# Altium schematic sheet USB2Serial.SchDoc
size A3; SheetTitle: USB2Serial; SheetNumber: 2
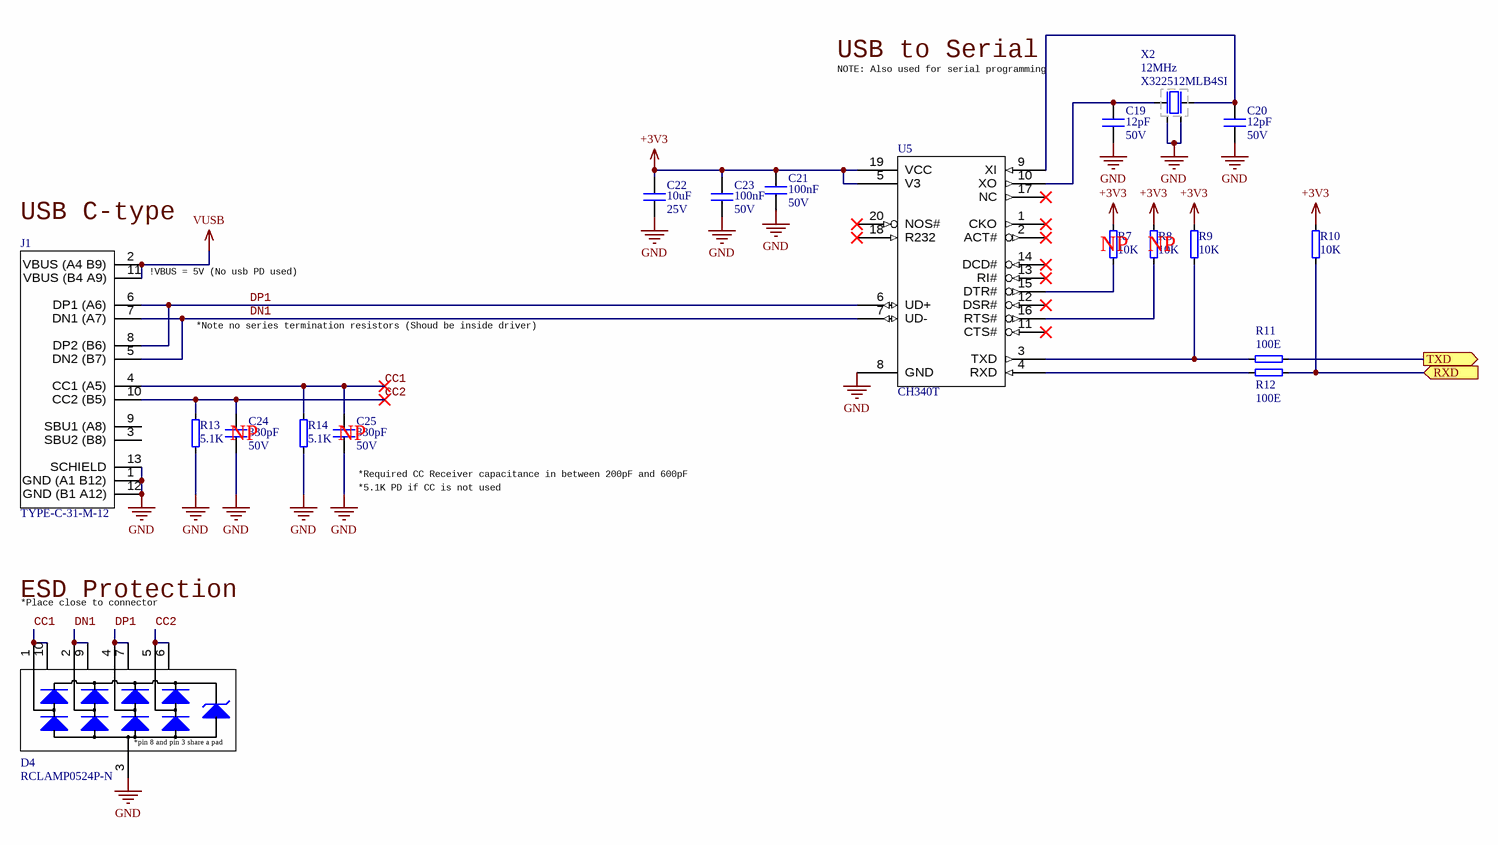
[diagram p0: USB2Serial.SchDoc]

## Parts
C19  12pF  Voltage: 50V  [CAP 0603 1608 IPC MEDIUM]
C20  12pF  Voltage: 50V  [CAP 0603 1608 IPC MEDIUM]
C21  100nF  Voltage: 50V  [CAP 0603 1608 IPC MEDIUM]
C22  10uF  Voltage: 25V  [CAP 1206 3216 IPC MEDIUM]
C23  100nF  Voltage: 50V  [CAP 0603 1608 IPC MEDIUM]
C24  330pF  Voltage: 50V  [CAP 0603 1608 IPC MEDIUM]
C25  330pF  Voltage: 50V  [CAP 0603 1608 IPC MEDIUM]
D4  RCLAMP0524P-N  [RCLAMP0524P-N - BORN]
J1  TYPE-C-31-M-12  [TYPE-C-31-M-12 - KOREAN HROPARTS ELEC]
R7  10K  [RES 0603 1608 IPC MEDIUM]
R8  10K  [RES 0603 1608 IPC MEDIUM]
R9  10K  [RES 0603 1608 IPC MEDIUM]
R10  10K  [RES 0603 1608 IPC MEDIUM]
R11  100E  [RES 0603 1608 IPC MEDIUM]
R12  100E  [RES 0603 1608 IPC MEDIUM]
R13  5.1K  [RES 0603 1608 IPC MEDIUM]
R14  5.1K  [RES 0603 1608 IPC MEDIUM]
U5  CH340T  [CH340T - WCH]
X2  X322512MLB4SI  Frequency: 12MHz  [X322512MLB4SI - YXC]

## Ports
RXD (in), TXD (out)

## Nets
+3V3: C21.1 C22.1 C23.1 R7.1 R8.1 R9.1 R10.1 U5.5(V3) U5.19(VCC)
GND: C19.2 C20.2 C21.2 C22.2 C23.2 C24.2 C25.2 D4.3(3_8) J1.1(GND_(A1_B12)) J1.12(GND_(B1_A12)) J1.13(SCHIELD) R13.2 R14.2 U5.8(GND) X2.2(GND) X2.4(GND)
VUSB: J1.2(VBUS_(A4_B9)) J1.11(VBUS_(B4_A9))
CC1: C25.1 D4.1 D4.10(NC) J1.4(CC1_(A5)) R14.1
CC2: C24.1 D4.5 D4.6(NC) J1.10(CC2_(B5)) R13.1
DN1: D4.2 D4.9(NC) J1.5(DN2_(B7)) J1.7(DN1_(A7)) U5.7(UD-)
DP1: D4.4 D4.7(NC) J1.6(DP1_(A6)) J1.8(DP2_(B6)) U5.6(UD+)
RXD: R10.2 R12.2 ; port RXD
TXD: R11.2 ; port TXD
NetC19_1: C19.1 U5.10(XO) X2.3(out)
NetC20_1: C20.1 U5.9(XI) X2.1(in)
NetR7_2: R7.2 U5.15(DTR#)
NetR8_2: R8.2 U5.16(RTS#)
NetR9_2: R9.2 R11.1 U5.3(TXD)
NetR12_1: R12.1 U5.4(RXD)

Not connected (* = marked no-connect by the designer): J1 3(SBU2_(B8)) 9(SBU1_(A8)); U5 1(CKO)* 2(ACT#)* 11(CTS#)* 12(DSR#)* 13(RI#)* 14(DCD#)* 17(NC)* 18(R232)* 20(NOS#)*

## Notes on the sheet
- USB to Serial
- NOTE: Also used for serial programming
- (near J1) USB C-type
- (near J1) !VBUS = 5V (No usb PD used)
- (near R7) NP
- (near R8) NP
- *Note no series termination resistors (Shoud be inside driver)
- (near C24) NP
- (near C25) NP
- (near C25) *5.1K PD if CC is not used
- (near C25) *Required CC Receiver capacitance in between 200pF and 600pF
- ESD Protection
- *Place close to connector
- Date:
- Client:
- Project:
- Sheet:
- Number:
- Title:
- of
- Size:
- Revision:
- A3
- File:
- Author:
- (in symbol 5) *pin 8 and pin 3 share a pad

## Library data of the parts
C19 C20 = 15: 12pF ±5% 50V NP0 0603 Multilayer Ceramic Capacitors MLCC - SMD/SMT RoHS; Part Number: CC0603JRNPO9BN120; Manufacturer: YAGEO; DB_ID: 15; Dielectric: C0G/NP0; Max Temperature: 125°C; Case Technology: SMT; Capacitance: 12pF; Tolerance: 5%; Supplier 1: LCSC; Supplier 2: Farnell; ComponentLink1Description: Octopart Search; ComponentLink1URL: https://octopart.com/cc0603jrnpo9bn120-yageo-9289271?r=sp; Supplier 3: Mouser; Supplier Part Number 1: C107034; Supplier Part Number 2: 721979; Supplier Part Number 3: 603-CC603JRNPO9BN120
C21 C23 = 62: 100nF ±10% 50V X7R 0603 Multilayer Ceramic Capacitors MLCC - SMD/SMT RoHS; Part Number: C0603B104K500NT; Manufacturer: TORCH; DB_ID: 62; Tolerance: 20%; Max Temperature: 125°C; Case Technology: SMT; Capacitance: 100nF; Dielectric: X7R; Supplier 1: LCSC; Supplier Part Number 1: C478888; ComponentLink1Description: Octopart Search; ComponentLink1URL: http://octopart.com/search?q=C0603C104M4RACTU%20KEMET
C22 = 86: 10uF ±10% 25V X5R 1206 Multilayer Ceramic Capacitors MLCC - SMD/SMT RoHS; Part Number: CL31A106KAHNNNE; Manufacturer: SAMSUNG; DB_ID: 86; Max Temperature: 85°C; Case Technology: SMT; Capacitance: 10uF; Dielectric: X5R; Tolerance: 10%; Supplier 1: LCSC; Supplier 2: Farnell; Supplier Part Number 1: C9807; ComponentLink1Description: Octopart Search; ComponentLink1URL: https://octopart.com/search?q=CL31A106KAHNNNE&currency=USD&specs=0; Supplier 3: Mouser; Supplier Part Number 2: 3013511; Supplier Part Number 3: 187-CL31A106KAHNNNE
C24 C25 = 32: Generic 0603 1608 Capacitor; Part Number: CL10C331JB8NNNC; Manufacturer: SAMSUNG; DB_ID: 32; Dielectric: C0G/NP0; Tolerance: 5%; Max Temperature: 125°C; Case Technology: SMT; Capacitance: 330pF; Supplier 1: LCSC; Supplier 2: Mouser; ComponentLink1Description: Octopart; ComponentLink1URL: https://octopart.com/cl10c331jb8nnnc-samsung-9287376?r=sp; Supplier 3: Digikey; Supplier Part Number 1: C1664; Supplier Part Number 2: 187-CL10C331JB8NNNC; Supplier Part Number 3: 1276-1073-1-ND
D4 = 5: TVS ARRAY, 40W, 5V, UNIDIRECTIONAL, USB, HDMI; Manufacturer: BORN; DB_ID: 5; Case Technology: SMT; V_BR (Min): 5.5 V; V_BR (max): 7.8 V; Part Number: RCLAMP0524P-N; Polarity: Unidirectional; Working Voltage: 5 V; P_PK: 40 W; Supplier 1: LCSC; Supplier Part Number 1: C316044; ComponentLink1Description: Octopart Search; ComponentLink1URL: https://octopart.com/search?q=RCLAMP0524P-N+BORN&currency=USD&specs=0; ComponentLink2Description: Datasheet; ComponentLink2URL: C:\Users\Admin\stack\Altium\Database_2.0\Datasheets\RCLAMP0524P-N - Datasheet - BORN.pdf; ComponentLink3Description: Product page; ComponentLink3URL: http://www.born-tw.com/
J1 = 54: USB - Type C Female 12-pin; Manufacturer: HRO ELECTRONICS; DB_ID: 54; Row count: 1; Case Technology: SMT; Part Number: TYPE-C-31-M-12; Subcategory: Wire-To-Board; Pin count: 12; Pitch: -; Orientation: Horizontal; Supplier 1: LCSC; Supplier Part Number 1: C165948; ComponentLink1Description: Octopart Search; ComponentLink1URL: https://octopart.com/type-c-31-m-12-hro+electronics-99357592?r=sp; ComponentLink2Description: Datasheet; ComponentLink2URL: C:\Users\Admin\stack\Altium\Database_2.0\Datasheets\TYPE-C-31-M-12 - Drawing - KOREAN HROPARTS ELEC.pdf; ComponentLink3Description: Product page; ComponentLink3URL: http://www.krhro.com/USBjack/20180124/764.html
R7-R10 = 99: 10kΩ ±1% 0.1W ±100ppm/℃ 0603 Chip Resistor - Surface Mount RoHS; Part Number: RC0603FR-0710KL; Manufacturer: YAGEO; DB_ID: 99; Case Technology: SMT; Voltage: 75V; Power: 100mW; Subcategory: Resistor E24 Range; Resistance: 10K; Tolerance: 1%; Supplier 1: LCSC; Supplier Part Number 1: C98220; Supplier 2: Farnell; ComponentLink1Description: Octopart Search; ComponentLink1URL: https://octopart.com/rc0603fr-0710kl-yageo-40025538?r=sp; Supplier 3: Digikey; Supplier Part Number 2: 2421850; Supplier Part Number 3: 311-10.0KHRCT-ND
R11 R12 = 51: 100Ω ±1.0% 1/10W ±100ppm/℃ Thick Film Resistors 75V -55℃~+155℃ 0603 Chip Resistor - Surface Mount RoHS; Part Number: RC0603FR-07100RL; Manufacturer: YAGEO; DB_ID: 51; Case Technology: SMT; Power: 100mW; Tolerance: 1%; Subcategory: Resistor E24 Range; Resistance: 100E; Voltage: 75V; Supplier 1: LCSC; Supplier Part Number 1: C105588; Supplier 2: Farnell; Supplier Part Number 2: 2421848; Supplier 3: Mouser; Supplier Part Number 3: 603-RC0603FR-07100RL; ComponentLink1Description: Octopart Search; ComponentLink1URL: https://octopart.com/rc0603fr-07100rl-yageo-55402879?r=sp#PriceAndStock
R13 R14 = 92: 5.1kΩ ±1% 0.1W 0603 Chip Resistor - Surface Mount RoHS; Part Number: RMC06035.1K1%N; Manufacturer: TYOHM; DB_ID: 92; Case Technology: SMT; Voltage: 50V; Power: 100mW; Subcategory: Resistor E24 Range; Resistance: 5.1K; Tolerance: 1%; Supplier 1: LCSC; Supplier Part Number 1: C269716
U5 = 76: USB to UART Bridge Controller USB 2.0 Full speed 50bps to 2Mbps; Manufacturer: WCH; DB_ID: 76; Case Technology: SMT; Vin min: 3.3 V; Vin max: 5.3 V; Part Number: CH340T; Subcategory: Drivers & Interfaces; Vin typ: -; Supplier 1: LCSC; Supplier Part Number 1: C8689; ComponentLink1Description: Octopart Search; ComponentLink1URL: https://octopart.com/search?q=CH340T&currency=USD&specs=0; ComponentLink2Description: Datasheet; ComponentLink2URL: C:\Users\Admin\stack\Altium\Database_2.0\Datasheets\CH340T - Datasheet - WCH.pdf; ComponentLink3Description: Product Page; ComponentLink3URL: http://www.wch-ic.com/products/CH340.html
X2 = 6: 12MHz ±10ppm 9pF 80Ω SMD-3225_4P Crystals RoHS; Manufacturer: YXC; DB_ID: 6; Case Technology: SMT; Min Temperature: -40°C; Max Temperature: 85°C; Part Number: X322512MLB4SI; Frequency Tolerance: 10ppm; Load Capacitance: 9pF; Supplier 1: LCSC; Supplier Part Number 1: C112971; ComponentLink1Description: Octopart Search; ComponentLink1URL: https://octopart.com/x322512mlb4si-yxc-99368244?r=sp; ComponentLink2Description: Datasheet; ComponentLink2URL: C:\Users\Admin\stack\Altium\Database_2.0\Datasheets\X322512MLB4SI - Datasheet - YXC.pdf; ComponentLink3Description: Product page; ComponentLink3URL: http://www.yxc.hk/3225smdjingzhen/YSX321SL.html